# Altium schematic sheet Programer Connectors_SPI.SchDoc
size 38 x 38 mm
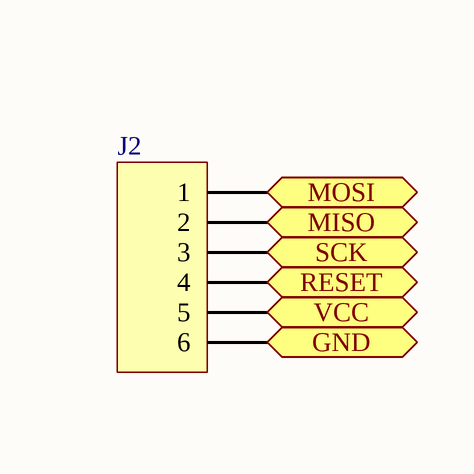
[diagram p0: Programer Connectors_SPI.SchDoc]

## Parts
J2  Header 6  [HDR1X6]  (value not drawn)

## Ports
GND (in), MISO (out), MOSI (out), RESET (out), SCK (out), VCC (in)

## Nets
GND: J2.6 ; port GND
MISO: J2.2 ; port MISO
MOSI: J2.1 ; port MOSI
RESET: J2.4 ; port RESET
SCK: J2.3 ; port SCK
VCC: J2.5 ; port VCC

## Library data of the parts
J2 = Header 6: Header, 6-Pin; LatestRevisionDate: 17-Jul-2002; LatestRevisionNote: Re-released for DXP Platform.; Publisher: Altium Limited